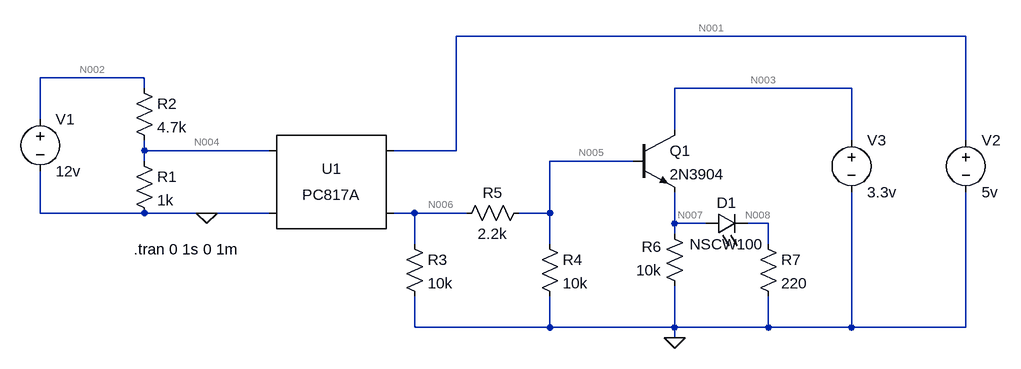
[diagram p0: schematic Prob 1_After.asc]
Prob 1_After.asc, the LTspice schematic file:
Version 4
SHEET 1 1612 680
WIRE 1168 -64 384 -64
WIRE -96 0 -256 0
WIRE -96 16 -96 0
WIRE 992 16 720 16
WIRE -256 64 -256 0
WIRE 720 80 720 16
WIRE 992 96 992 16
WIRE 1168 96 1168 -64
WIRE -96 112 -96 96
WIRE 96 112 -96 112
WIRE 384 112 384 -64
WIRE 384 112 288 112
WIRE -96 128 -96 112
WIRE 656 128 528 128
WIRE -256 208 -256 144
WIRE -96 208 -256 208
WIRE 0 208 -96 208
WIRE 96 208 0 208
WIRE 320 208 288 208
WIRE 400 208 320 208
WIRE 528 208 528 128
WIRE 528 208 480 208
WIRE 720 224 720 176
WIRE 768 224 720 224
WIRE 864 224 832 224
WIRE 720 240 720 224
WIRE 320 256 320 208
WIRE 528 256 528 208
WIRE 864 256 864 224
WIRE 320 384 320 336
WIRE 528 384 528 336
WIRE 528 384 320 384
WIRE 720 384 720 320
WIRE 720 384 528 384
WIRE 864 384 864 336
WIRE 864 384 720 384
WIRE 992 384 992 176
WIRE 992 384 864 384
WIRE 1168 384 1168 176
WIRE 1168 384 992 384
WIRE 720 400 720 384
FLAG 0 208 0
FLAG 720 400 0
SYMBOL Optos\\PC817A 192 160 R0
SYMATTR InstName U1
SYMBOL res -112 112 R0
SYMATTR InstName R1
SYMATTR Value 1k
SYMBOL res -112 0 R0
SYMATTR InstName R2
SYMATTR Value 4.7k
SYMBOL npn 656 80 R0
SYMATTR InstName Q1
SYMATTR Value 2N3904
SYMBOL res 496 192 R90
WINDOW 0 0 56 VBottom 2
WINDOW 3 32 56 VTop 2
SYMATTR InstName R5
SYMATTR Value 2.2k
SYMBOL voltage -256 48 R0
WINDOW 123 0 0 Left 0
WINDOW 39 0 0 Left 0
SYMATTR InstName V1
SYMATTR Value 12v
SYMBOL voltage 1168 80 R0
WINDOW 123 0 0 Left 0
WINDOW 39 0 0 Left 0
SYMATTR InstName V2
SYMATTR Value 5v
SYMBOL res 304 240 R0
SYMATTR InstName R3
SYMATTR Value 10k
SYMBOL res 512 240 R0
SYMATTR InstName R4
SYMATTR Value 10k
SYMBOL res 736 336 R180
WINDOW 0 36 76 Left 2
WINDOW 3 36 40 Left 2
SYMATTR InstName R6
SYMATTR Value 10k
SYMBOL voltage 992 80 R0
WINDOW 123 0 0 Left 0
WINDOW 39 0 0 Left 0
SYMATTR InstName V3
SYMATTR Value 3.3v
SYMBOL LED 768 240 R270
WINDOW 0 32 32 VTop 2
WINDOW 3 0 32 VBottom 2
SYMATTR InstName D1
SYMATTR Value NSCW100
SYMATTR Description Diode
SYMATTR Type diode
SYMBOL res 848 240 R0
SYMATTR InstName R7
SYMATTR Value 220
TEXT -112 264 Left 2 !.tran 0 1s 0 1m

The netlist it stands for:
* Prob 1_After.asc
XU1 N004 0 N001 N006 PC817 Igain=1m
R1 N004 0 1k
R2 N002 N004 4.7k
Q1 N003 N005 N007 0 2N3904
R5 N005 N006 2.2k
V1 N002 0 12v
V2 N001 0 5v
R3 N006 0 10k
R4 N005 0 10k
R6 0 N007 10k
V3 N003 0 3.3v
D1 N007 N008 NSCW100
R7 N008 0 220
.model D D
.lib standard.dio
.model NPN NPN
.model PNP PNP
.lib standard.bjt
.tran 0 1s 0 1m
.lib PC817.sub
.backanno
.end

* Results of the author's LTspice run, read from the files saved beside the schematic
* Operating Point, zero values left out:
*   V(n004) = 1.022 V
*   V(n001) = 5 V
*   V(n006) = 4.808 V
*   V(n002) = 12 V
*   V(n003) = 3.3 V
*   V(n005) = 3.891 V
*   V(n007) = 3.217 V
*   V(n008) = 351.5 mV
*   Ic(Q1) = 1.892 mA
*   Ib(Q1) = 27.63 µA
*   Ie(Q1) = -1.919 mA
*   I(D1) = 1.598 mA
*   I(R7) = 1.598 mA
*   I(R6) = -321.7 µA
*   I(R4) = 389.1 µA
*   I(R3) = 480.8 µA
*   I(R5) = -416.8 µA
*   I(R2) = 2.336 mA
*   I(R1) = 1.022 mA
*   I(V3) = -1.892 mA
*   I(V2) = -897.6 µA
*   I(V1) = -2.336 mA
*   Ix(u1:1) = 1.314 mA
*   Ix(u1:2) = -1.314 mA
*   Ix(u1:3) = 897.6 µA
*   Ix(u1:4) = -897.6 µA